# Altium schematic sheet uController_Untilities.SchDoc
size A3; SheetNumber: 1; SheetTotal: 2
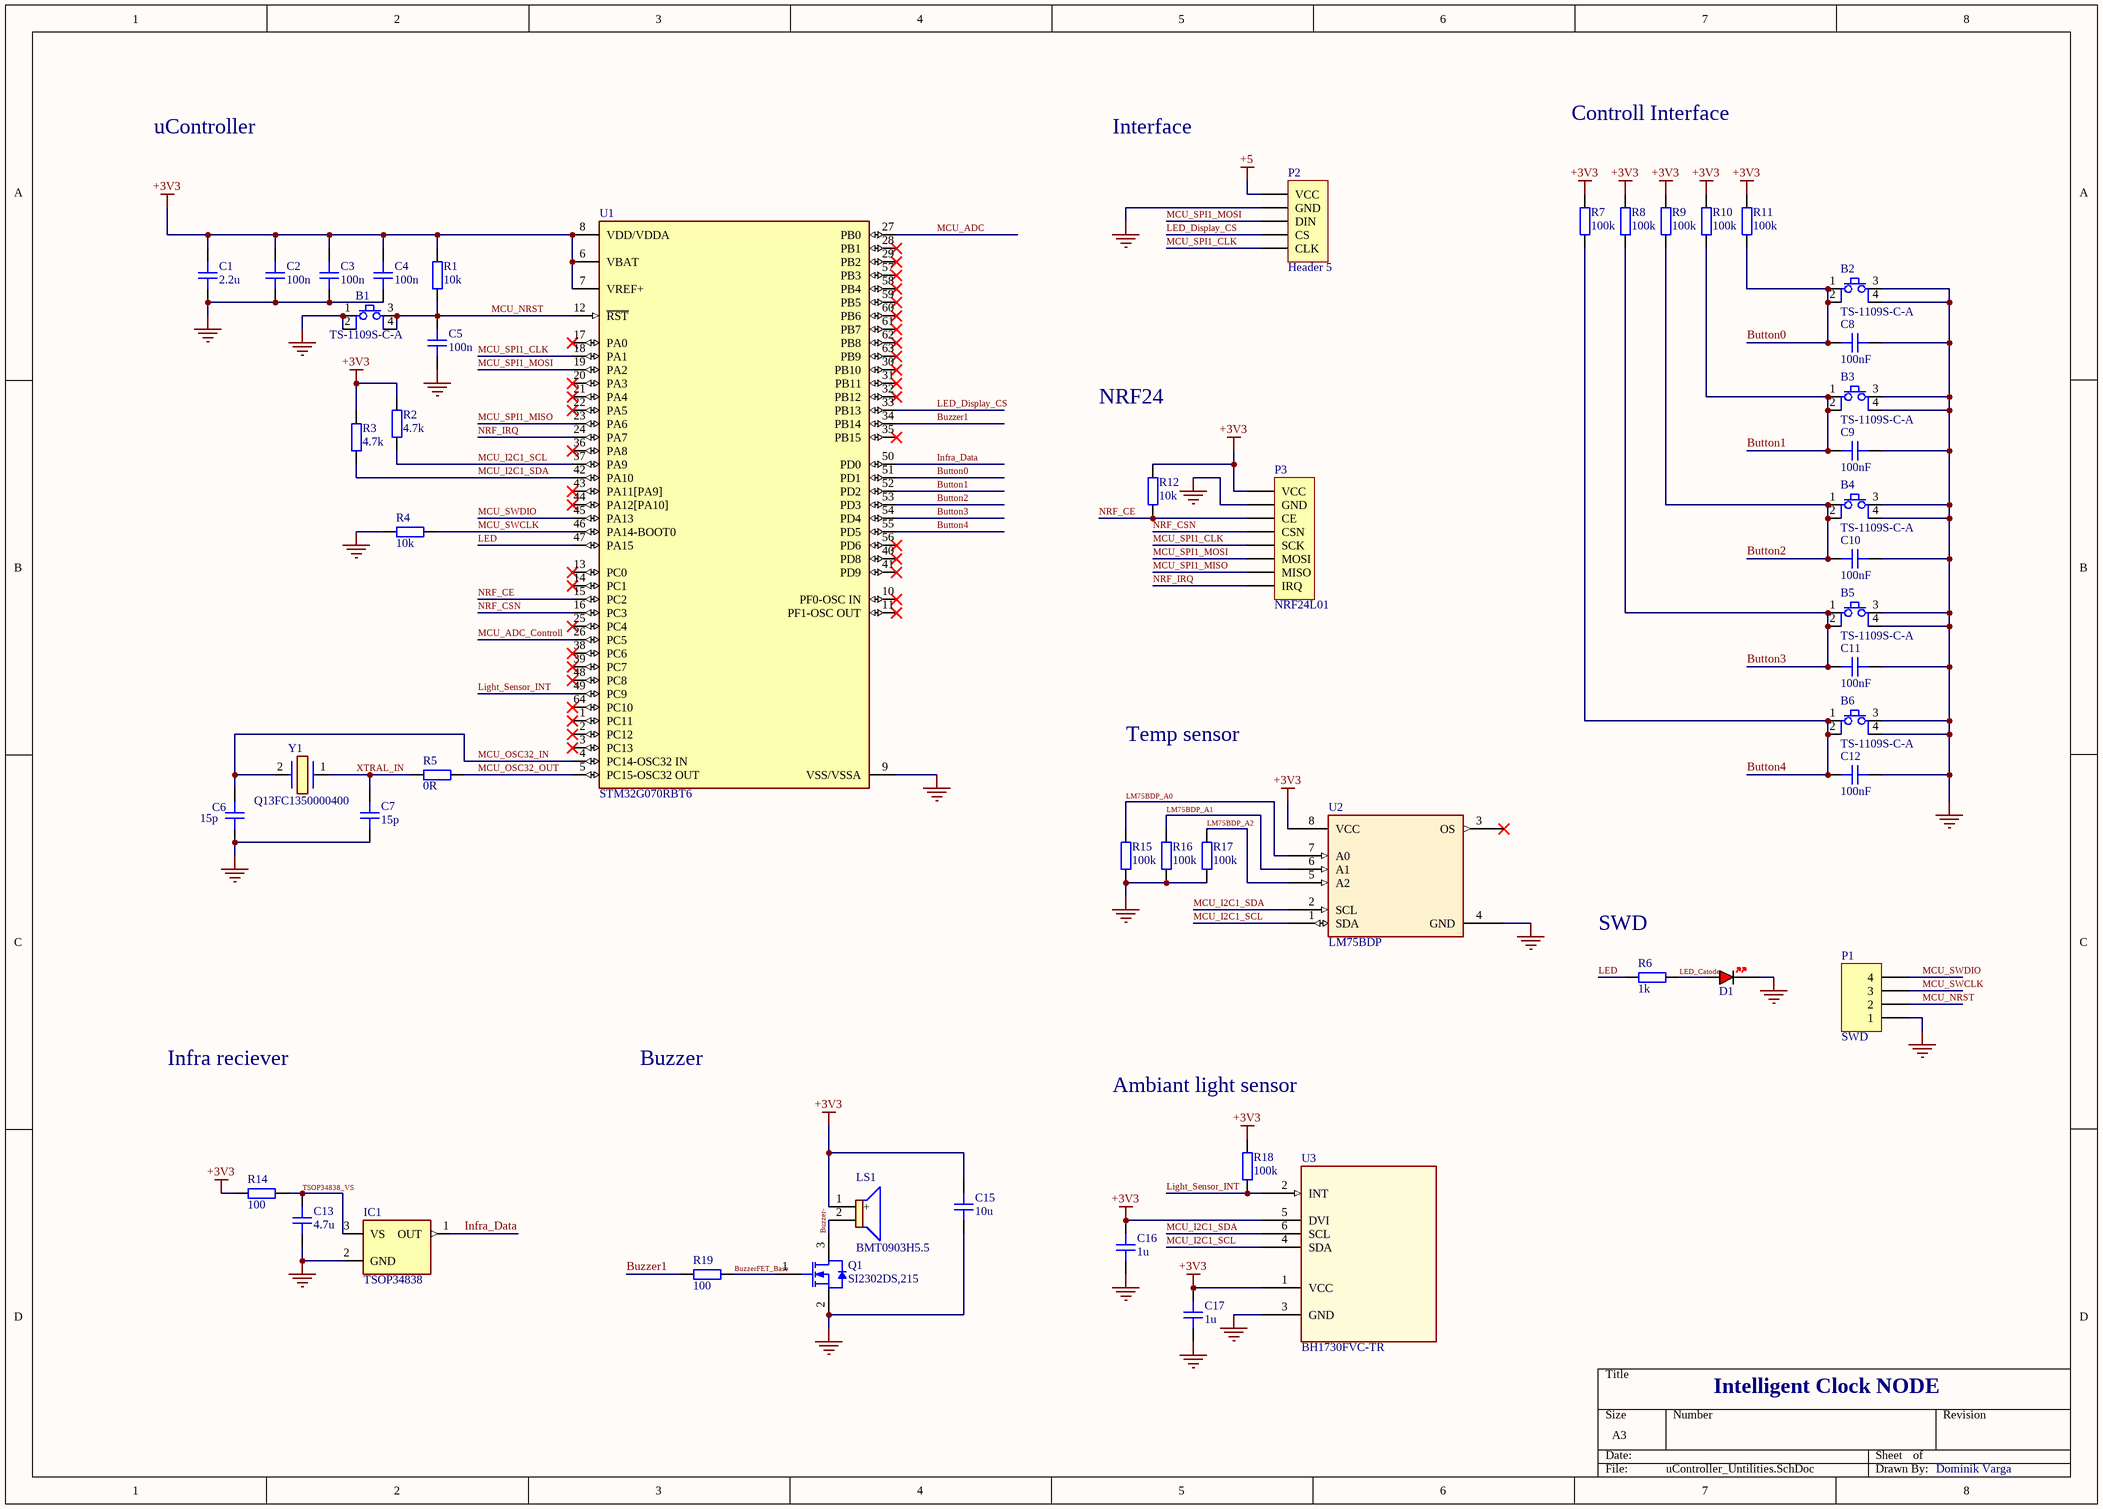
[diagram p0: uController_Untilities.SchDoc]

## Parts
B1  TS-1109S-C-A  [SMD_Button]
B2  TS-1109S-C-A  [SMD_Button]
B3  TS-1109S-C-A  [SMD_Button]
B4  TS-1109S-C-A  [SMD_Button]
B5  TS-1109S-C-A  [SMD_Button]
B6  TS-1109S-C-A  [SMD_Button]
C1  2.2u  [CAP_0603]
C2  100n  [CAP_0603]
C3  100n  [CAP_0603]
C4  100n  [CAP_0603]
C5  100n  [CAP_0603]
C6  15p  [CAP_0603]
C7  15p  [CAP_0603]
C8  100nF  [CAP_0603]
C9  100nF  [CAP_0603]
C10  100nF  [CAP_0603]
C11  100nF  [CAP_0603]
C12  100nF  [CAP_0603]
C13  4.7u  [CAP_0603]
C15  10u  [CAP_0603]
C16  1u  [CAP_0603]
C17  1u  [CAP_0603]
D1  RED  [LED_0603_RED]  (value not drawn)
IC1  TSOP34838  [TSOP4856]
LS1  BMT0903H5.5  [BMT0903H5.5]
P1  SWD  [HDR1X4]
P2  Header 5  [HDR1X5]
P3  NRF24L01  [MHDR1X8]
Q1  SI2302DS,215  [NXP-SOT23_N]
R1  10k  [RES_0603]
R2  4.7k  [RES_0603]
R3  4.7k  [RES_0603]
R4  10k  [RES_0603]
R5  0R  [RES_0603]
R6  1k  [RES_0603]
R7  100k  [RES_0603]
R8  100k  [RES_0603]
R9  100k  [RES_0603]
R10  100k  [RES_0603]
R11  100k  [RES_0603]
R12  10k  [RES_0603]
R14  100  [RES_0603]
R15  100k  [RES_0603]
R16  100k  [RES_0603]
R17  100k  [RES_0603]
R18  100k  [RES_0603]
R19  100  [RES_0603]
U1  STM32G070RBT6  [FP-LQFP64-5W-MFG]
U2  LM75BDP  [TSSOP8_3P1X3P1_NXP-M]
U3  BH1730FVC-TR  [SON_30FVC-TR_ROM-M]
Y1  Q13FC1350000400  [Q13FC1350000400]

## Nets
+3V3: C1.2 C2.2 C3.2 C4.2 C15.1 C16.2 C17.2 LS1.1(+) P3.1(VCC) R1.2 R2.1 R3.1 R7.2 R8.2 R9.2 R10.2 R11.2 R12.1 R14.1 R18.1 U1.6(VBAT) U1.7(VREF+) U1.8(VDD/VDDA) U2.8(VCC) U3.1(VCC) U3.5(DVI)
+5: P2.1(VCC)
GND: B1.1 B1.2 B2.3 B2.4 B3.3 B3.4 B4.3 B4.4 B5.3 B5.4 B6.3 B6.4 C1.1 C2.1 C3.1 C4.1 C5.1 C6.1 C7.1 C8.2 C9.2 C10.2 C11.2 C12.2 C13.1 C15.2 C16.1 C17.1 D1.K IC1.2(GND) P1.1 P2.2(GND) P3.2(GND) Q1.2(S) R4.2 R15.2 R16.2 R17.2 U1.9(VSS/VSSA) U2.4(GND) U3.3(GND)
Button0: B2.1 B2.2 C8.1 R11.1 U1.51(PD1)
Button1: B3.1 B3.2 C9.1 R10.1 U1.52(PD2)
Button2: B4.1 B4.2 C10.1 R9.1 U1.53(PD3)
Button3: B5.1 B5.2 C11.1 R8.1 U1.54(PD4)
Button4: B6.1 B6.2 C12.1 R7.1 U1.55(PD5)
Buzzer1: R19.1 U1.34(PB14)
Buzzer-: LS1.2 Q1.3(D)
BuzzerFET_Base: Q1.1(G) R19.2
Infra_Data: IC1.1(OUT) U1.50(PD0)
LED: R6.2 U1.47(PA15)
LED_Catode: D1.A R6.1
LED_Display_CS: P2.4(CS) U1.33(PB13)
Light_Sensor_INT: R18.2 U1.49(PC9) U3.2(INT)
LM75BDP_A0: R15.1 U2.7(A0)
LM75BDP_A1: R16.1 U2.6(A1)
LM75BDP_A2: R17.1 U2.5(A2)
MCU_ADC: U1.27(PB0)
MCU_ADC_Controll: U1.26(PC5)
MCU_I2C1_SCL: R2.2 U1.37(PA9) U2.1(SDA) U3.4(SDA)
MCU_I2C1_SDA: R3.2 U1.42(PA10) U2.2(SCL) U3.6(SCL)
MCU_NRST: B1.3 B1.4 C5.2 P1.2 R1.1 U1.12(~{RST})
MCU_OSC32_IN: C6.2 U1.4(PC14-OSC32_IN) Y1.2(CRYSTAL_2)
MCU_OSC32_OUT: R5.1 U1.5(PC15-OSC32_OUT)
MCU_SPI1_CLK: P2.5(CLK) P3.5(SCK) U1.18(PA1)
MCU_SPI1_MISO: P3.7(MISO) U1.23(PA6)
MCU_SPI1_MOSI: P2.3(DIN) P3.6(MOSI) U1.19(PA2)
MCU_SWCLK: P1.3 R4.1 U1.46(PA14-BOOT0)
MCU_SWDIO: P1.4 U1.45(PA13)
NRF_CE: P3.3(CE) R12.2 U1.15(PC2)
NRF_CSN: P3.4(CSN) U1.16(PC3)
NRF_IRQ: P3.8(IRQ) U1.24(PA7)
TSOP34838_VS: C13.2 IC1.3(VS) R14.2
XTRAL_IN: C7.2 R5.2 Y1.1

Not connected (* = marked no-connect by the designer): U1 1(PC11)* 2(PC12)* 3(PC13)* 10(PF0-OSC_IN)* 11(PF1-OSC_OUT)* 13(PC0)* 14(PC1)* 17(PA0)* 20(PA3)* 21(PA4)* 22(PA5)* 25(PC4)* 28(PB1)* 29(PB2)* 30(PB10)* 31(PB11)* 32(PB12)* 35(PB15)* 36(PA8)* 38(PC6)* 39(PC7)* 40(PD8)* 41(PD9)* 43(PA11[PA9])* 44(PA12[PA10])* 48(PC8)* 56(PD6)* 57(PB3)* 58(PB4)* 59(PB5)* 60(PB6)* 61(PB7)* 62(PB8)* 63(PB9)* 64(PC10)*; U2 3(OS)*

## Notes on the sheet
- uController
- Interface
- Controll Interface
- NRF24
- Temp sensor
- (near R5) Do not place resistor
  32.768kHz - 10-25Mohm
- (near R6) SWD
- Infra reciever
- Buzzer
- Ambiant light sensor
- Intelligent Clock NODE
- Dominik Varga

## Library data of the parts
B1-B6 = TS-1109S-C-A: Basic SMD button; Manufacturer: XKB Connectivity; Manufacturer Part Number: TS-1109S-C-A; Datasheet: https://datasheet.lcsc.com/lcsc/2110151730_XKB-Connectivity-TS-1109S-C-A_C397346.pdf
C1-C13 C15-C17 = CAP_0603_10V: Capacitor SMD 0603 10V
D1 = LED_0603_RED: LED 0603 RED SMD
IC1 = TSOP34838: Integrated Circuit; Manufacturer_Name: Vishay; Datasheet Link: https://www.vishay.com/docs/82489/tsop322.pdf; Manufacturer_Part_Number: TSOP34838; Mouser Part Number: 782-TSOP34838; Mouser Price/Stock: https://www.mouser.co.uk/ProductDetail/Vishay-Semiconductors/TSOP34838?qs=mI1nX2bqwFnDB6kD41OpRA%3D%3D; Arrow Part Number: TSOP34838; Arrow Price/Stock: https://www.arrow.com/en/products/tsop34838/vishay?region=europe
LS1 = BMT0903H5.5: Loudspeaker or Buzzer; Manufacturer: BESTAR,LOUDITY; Datasheet Link: https://www.hestore.hu/prod_getfile.php?id=4603; Height: 5.5mm; Manufacturer Part Number: BMT0903H5.5
P1 = Header 4: Header, 4-Pin; LatestRevisionDate: 17-Jul-2002; LatestRevisionNote: Re-released for DXP Platform.; Publisher: Altium Limited
P2 = Header 5: Header, 5-Pin; LatestRevisionDate: 17-Jul-2002; LatestRevisionNote: Re-released for DXP Platform.; Publisher: Altium Limited
P3 = MHDR1X8: Header, 8-Pin; LatestRevisionDate: 17-Jul-2002; LatestRevisionNote: Re-released for DXP Platform.; Publisher: Altium Limited
Q1 = CMP-1258-00133-1: N-Channel Enhancement Mode Field-Effect Transistor, 20 V, 2.5 A, 3-Pin SOT23, Tape and Reel; Manufacturer: NXP Semiconductors; Ciss [typ] (pF): 230; VDS [max] (V): 20; Channel Type: N; Coss [typ] (pF): 125; ID [max] (A): 2.5; Packing: Tape & Reel; DatasheetVersion: Rev. 02; PackageVersion: 06-03-16, 03/2006; Code_JEDEC: TO-236AB; ComponentLink3Description: Package Specification; PartNumber: SI2302DS,215; ComponentLink2URL: http://www.nxp.com/documents/data_sheet/SI2302DS.pdf; PackageDescription: 3-Pin Small Outline Transistor Package, Body 2.9 x 1.3 mm, Pitch 0.95 mm; ComponentLink2Description: Datasheet; ComponentLink1Description: Manufacturer URL; Mounting Technology: Surface Mount; ComponentLink1URL: http://www.nxp.com/; ComponentLink3URL: http://www.nxp.com/documents/outline_drawing/sot023_po.pdf; PackageReference: SOT23
R1-R12 R14-R19 = RES_0603: Resistor SMD 0603
U1 = CMP-12105-000143-1: IC MCU 32BIT 128KB FLASH 64LQFP; RoHS Compliant: Yes
U2 = LM75BDP: No Description Available; Mfr_Name: NXP; Copyright: Copyright (C) 2022 Ultra Librarian. All rights reserved.; Manufacturer_Part_Number: LM75BDP; RefDes: RefDes; Type: DEV
U3 = BH1730FVC-TR: Ambiant Light Sensor; Mfr_Name: ROHM Semiconductor; Copyright: Copyright (C) 2022 Ultra Librarian. All rights reserved.; Manufacturer_Part_Number: BH1730FVC-TR; RefDes: RefDes; Type: DEV; datasheet: https://datasheet.lcsc.com/lcsc/1808091713_ROHM-Semicon-BH1730FVC-TR_C79616.pdf
Y1 = Q13FC1350000400: Crystal or Oscillator; Manufacturer_Name: Seiko Instruments Inc.; Datasheet Link: https://datasheet.lcsc.com/szlcsc/1901081604_Seiko-Epson-Q13FC1350000400_C32346.pdf; Height: 0.9mm; Manufacturer_Part_Number: Q13FC1350000400